# EAGLE design PowerBoard (EAGLE 6.5.0)
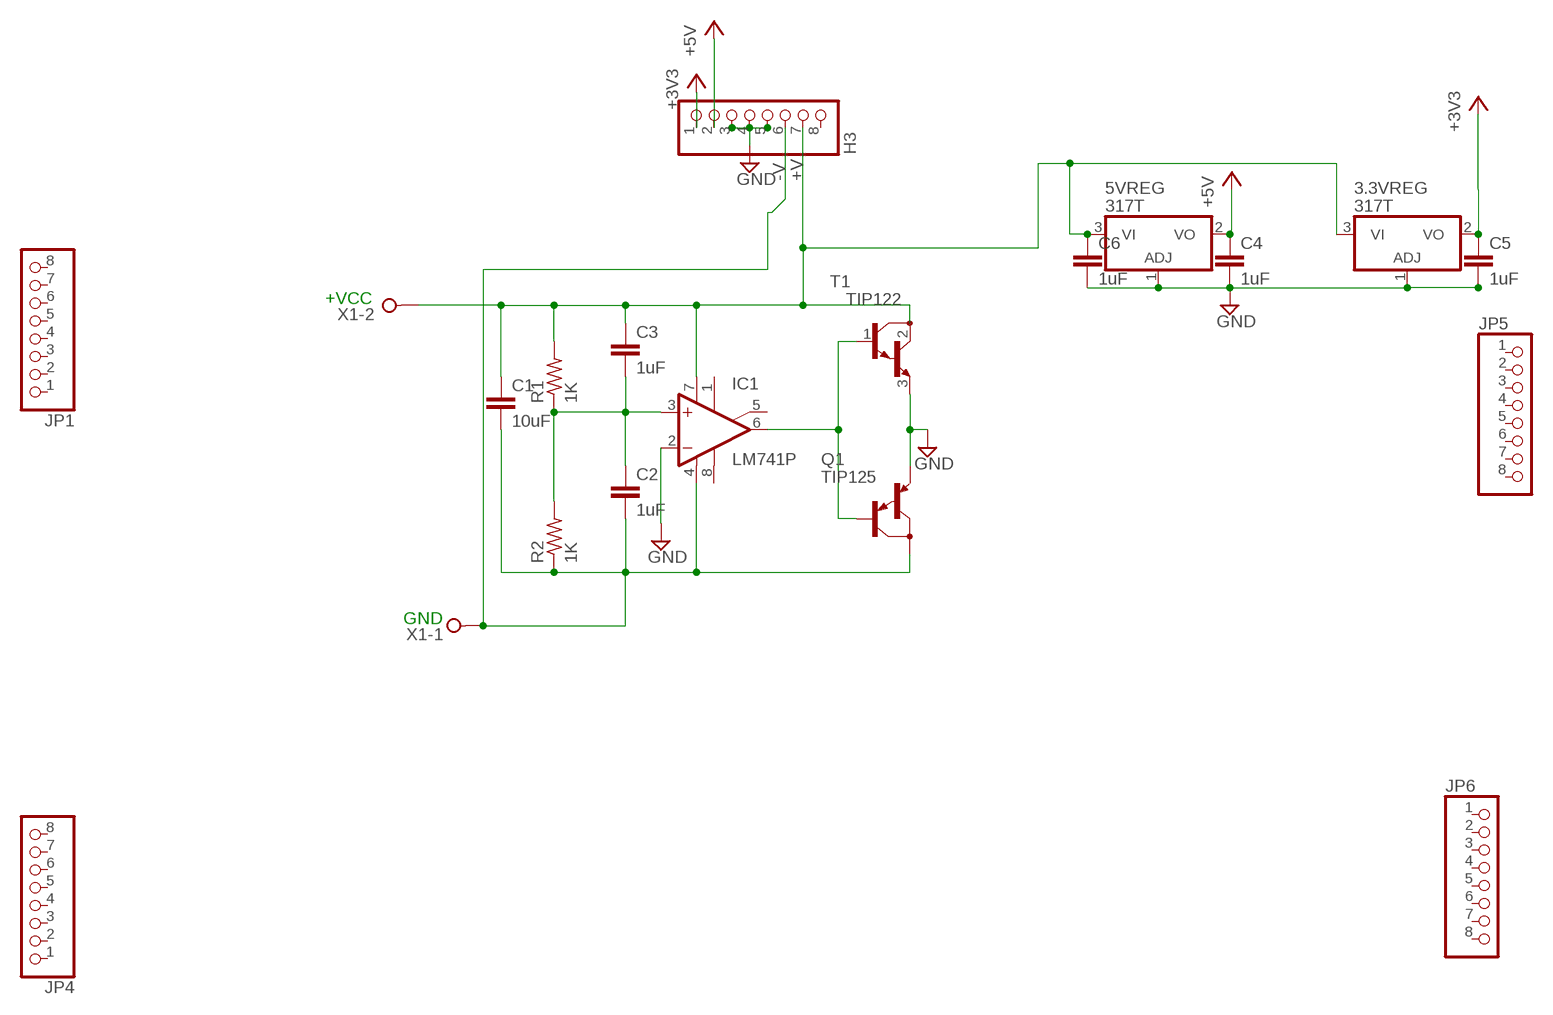
[diagram p0: schematic, sheet 1]

## Parts
3.3VREG  317T  [TO220H]
5VREG  317T  [TO220H]
C1  10uF  C2.5/2  [C2.5-2]
C2  1uF  C2.5/2  [C2.5-2]
C3  1uF  C2.5/2  [C2.5-2]
C4  1uF  C2.5/2  [C2.5-2]
C5  1uF  C2.5/2  [C2.5-2]
C6  1uF  C2.5/2  [C2.5-2]
IC1  LM741P  [DIL08]
JP1  PINHD-1X8  [1X08]
JP3  H3  PINHD-1X8  [1X08]
JP4  PINHD-1X8  [1X08]
JP5  PINHD-1X8  [1X08]
JP6  PINHD-1X8  [1X08]
Q1  TIP125  [TO220]
R1  1K  R-US_0207/7  [0207/7]
R2  1K  R-US_0207/7  [0207/7]
T1  TIP122  [TO220]
X1  W237-02P  [W237-132]

## Nets
+3V3: 3.3VREG.2(VO) C5.1 JP3.1
+5V: 5VREG.2(VO) C4.1 JP3.2
GND: 3.3VREG.1(ADJ) 5VREG.1(ADJ) C4.2 C5.2 C6.2 IC1.2(-IN) JP3.3 JP3.4 JP3.5 Q1.3(E) T1.3(E)
N$3: C1.2 C2.2 IC1.4(V-) JP3.6 Q1.2(C) R2.1 X1.1
N$4: 3.3VREG.3(VI) 5VREG.3(VI) C1.1 C3.1 C6.1 IC1.7(V+) JP3.7 R1.2 T1.2(C) X1.2
N$5: IC1.6(OUT) Q1.1(B) T1.1(B)
N$6: C2.1 C3.2 IC1.3(+IN) R1.1 R2.2
Unconnected: IC1.1(ON1) IC1.5(ON2) IC1.8(OPT) JP1.1 JP1.2 JP1.3 JP1.4 JP1.5 JP1.6 JP1.7 JP1.8 JP3.8 JP4.1 JP4.2 JP4.3 JP4.4 JP4.5 JP4.6 JP4.7 JP4.8 JP5.1 JP5.2 JP5.3 JP5.4 JP5.5 JP5.6 JP5.7 JP5.8 JP6.1 JP6.2 JP6.3 JP6.4 JP6.5 JP6.6 JP6.7 JP6.8

## Notes on the sheet
- -V | +V
- +VCC
- GND

## Library data of the parts
3.3VREG 5VREG = linear:*317: Positive VOLTAGE REGULATOR
C1-C6 = capacitor-wima:C: CAPACITOR naming: grid - package width
IC1 = linear:*741: OP AMP
JP1 JP3-JP6 = pinhead:PINHD-1X8: PIN HEADER
Q1 = transistor-pnp:TIP125: PNP Transistor
R1 R2 = resistor:R-US_: RESISTOR, American symbol
T1 = transistor:TIP122: NPN BIPOLAR DARLINGTON TRANSISTOR
X1 = con-wago-508:W237-02P: WAGO SREW CLAMP; OC_FARNELL: unknown; OC_NEWARK: unknown

## Board
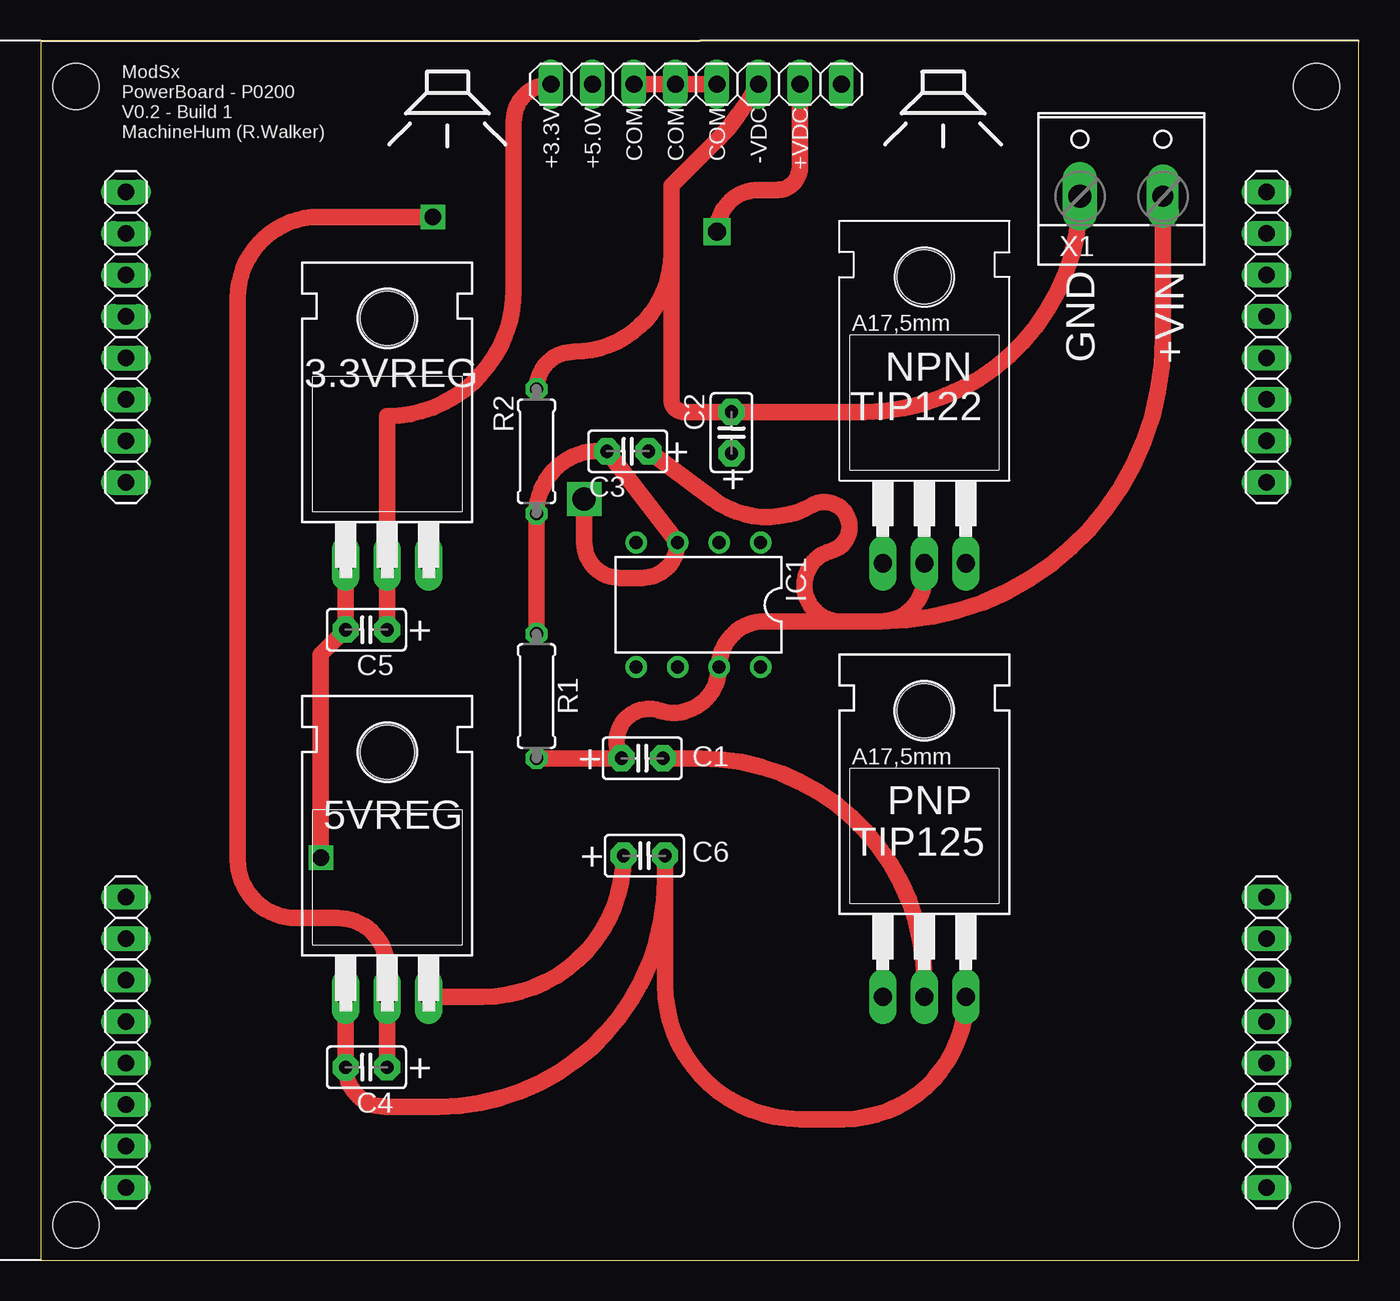
[diagram p1: board, top side]
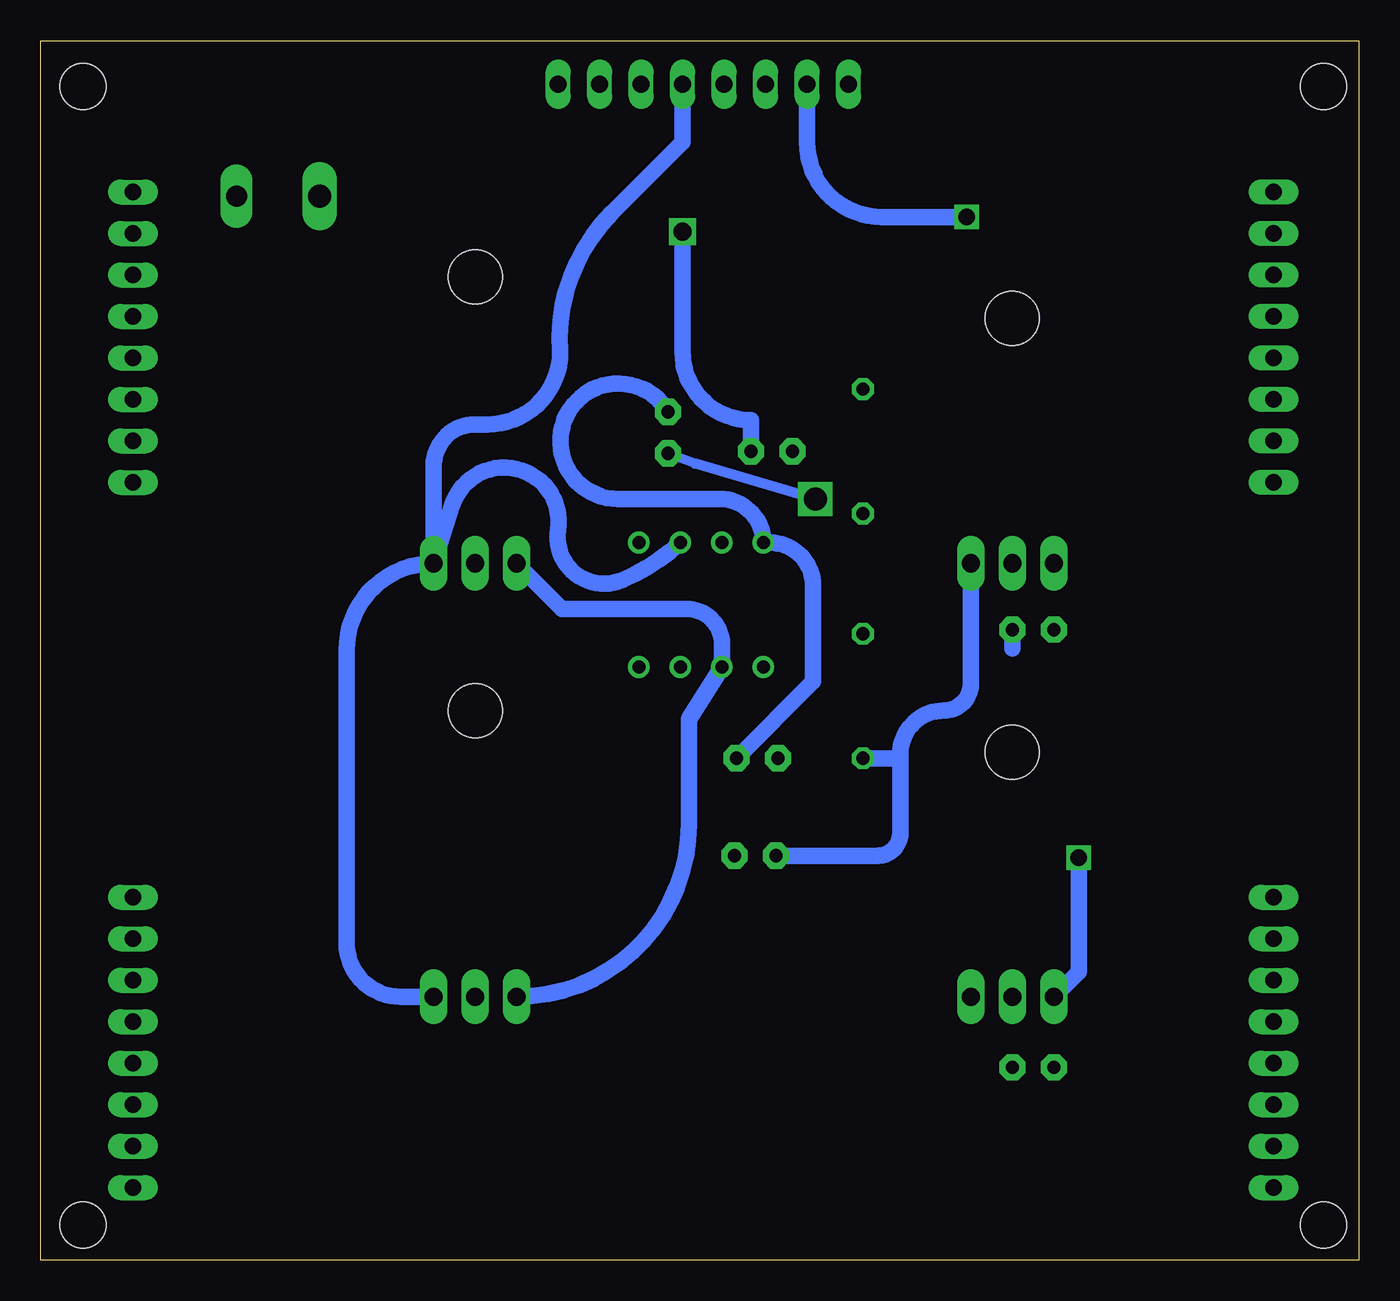
[diagram p2: board, bottom side, seen from below]

Size 80.7 x 74.67 mm. Coordinates in mm from the lower left corner, seen from the top.
Outline: 0,0 80.7,0 80.7,74.67 0,74.67 0,0
Copper layers (1*16): Top 0.035mm / dielectric 1.5mm / Bottom 0.035mm
Design rules "default": minimum track width 10mil, minimum drill 24mil, track to track 8mil, track to pad 8mil, pad to pad 8mil, via to via 8mil, smd to smd 8mil, copper to edge 40mil, drill to drill 8mil, minimum pad ring 10mil, minimum via ring 8mil, stop-mask expansion 4mil, vias tented up to drill 0mil, thermal gap 10mil
Holes 2.8 mm at 2.16,71.88 2.16,2.16 78.11,71.88 78.11,2.16

### Footprints (pad centres in the part's own frame; a part is rotated, then mirrored left to right if it is on the bottom)
TO220H = drill 1.118 long: 1 -2.54,-10.16; 2 0,-10.16; 3 2.54,-10.16 | hole 3.302: 0,4.826
C2.5-2 = drill 0.813 pad 1.6 octagon: 1 -1.27,0; 2 1.27,0
DIL08 = drill 0.813 pad 1.27: 1 -3.81,-3.81; 2 -1.27,-3.81; 3 1.27,-3.81; 4 3.81,-3.81; 5 3.81,3.81; 6 1.27,3.81; 7 -1.27,3.81; 8 -3.81,3.81
1X08 = drill 1.016 long: 1 -8.89,0; 2 -6.35,0; 3 -3.81,0; 4 -1.27,0; 5 1.27,0; 6 3.81,0; 7 6.35,0; 8 8.89,0
TO220 = drill 1.118 long: 1 -2.54,-6.35; 2 0,-6.35; 3 2.54,-6.35 | hole 3.302: 0,11.176
0207/7 = drill 0.813 octagon: 1 -3.81,0; 2 3.81,0
W237-132 = drill 1.4 long: 1 -2.54,-0.635 | drill 1.3 long: 2 2.54,-0.635

### Placement (x,y rotation side)
3.3VREG  21.21,52.83 0 top
5VREG  21.21,26.29 0 top
C1  36.83,30.73 0 top
C2  42.29,50.67 90 top
C3  35.94,49.53 180 top
C4  19.94,11.81 180 top
C5  19.94,38.61 180 top
C6  36.96,24.77 0 top
IC1  40.26,40.13 180 top
JP1  5.21,56.52 270 top
JP3  40.13,72.01 0 top
JP4  5.21,13.34 90 top
JP5  75.06,13.34 90 top
JP6  75.06,56.52 90 top
Q1  54.1,22.48 0 top
R1  30.35,34.54 270 top
R2  30.35,49.53 270 top
T1  54.1,49.02 0 top
X1  66.17,65.79 0 top

### Tracks (layer width: path | path; a pad name or v marks a point on that pad's centre or on a via)
+3V3
  Top 1.016: C5.1 3.3VREG.2 21.21,51.69 arc90 28.96,59.44 28.96,69.72 arc-90 JP3.1
  Bottom 1.016: 21.21,37.47 C5.1
+5V  (via drill 1)
  Top 1.016: v24,63.88 17.02,63.88 arc90 12.06,58.93 arc90 12.06,58.8 12.06,24.51 arc90 15.62,20.95 18.16,20.95 arc-90 21.21,17.91 5VREG.2 C4.1
  Bottom 1.016: v24,63.88 29.21,63.88 arc90 33.78,68.45 JP3.2
GND  (via drill 1)
  Top 1.016: JP3.5 JP3.4 JP3.3 | 5VREG.1 C4.2 arc90 21.08,9.4 24.38,9.4 arc90 38.23,23.24 C6.2 38.23,16.89 arc90 46.48,8.64 49.15,8.64 arc90 Q1.3 | 3.3VREG.1 C5.2 17.14,37.08 v17.14,24.64
  Bottom 1.016: T1.3 arc-90 61.98,37.34 61.98,19.43 arc-90 58.67,16.13 Q1.3 | T1.3 55.5,46.23 arc171 49.02,44.7 arc-122 45.09,41.66 arc-19 IC1.2 | JP3.5 41.4,68.45 45.72,64.14 arc-49 48.9,55.63 arc90 53.34,51.18 54.1,51.18 arc-90 56.64,48.64 T1.3 | v17.14,24.64 17.14,17.65 5VREG.1
N$3
  Top 1.016: JP3.6 arc-16 41.27,68.45 38.61,65.79 38.61,61.59 | R2.1 arc-90 32.64,55.63 arc90 38.61,61.59 | Q1.2 54.1,17.02 arc90 40.39,30.73 C1.2 | X1.1 arc-90 50.42,51.94 C2.2 39.37,51.94 arc-90 38.61,52.7 38.61,61.59
  Bottom 1.016: C2.2 arc-239 45.34,46.61 39.12,46.61 arc90 IC1.4 36.07,43.94 arc90 33.4,41.27 33.4,35.43 C1.2
N$4  (via drill 1.1)
  Top 1.016: R1.2 C1.1 arc-140 37.85,33.66 arc108 IC1.7 arc-90 44.32,39.12 49.02,39.12 | T1.2 54.1,41.78 arc-90 51.44,39.12 | 51.44,39.12 49.02,39.12 | C3.1 41.15,46.61 arc66 47.24,46.23 arc-194 48.39,43.43 arc167 49.02,39.12 | 5VREG.3 27.05,16.13 arc90 C6.1 | X1.2 68.71,56.39 arc-90 51.44,39.12 | 46.48,70.87 JP3.7 46.48,66.93 arc-90 45.09,65.53 43.94,65.53 arc90 v41.4,62.99
  Bottom 1.016: C3.1 37.21,51.44 arc90 41.4,55.63 v41.4,62.99 | 3.3VREG.3 23.75,35.31 arc90 25.4,33.66 arc-90 28.07,30.99 | 28.07,30.99 28.07,26.16 arc90 29.46,24.77 C6.1 | R1.2 28.32,30.73 arc-90 28.07,30.99
N$5
  Bottom 1.016: T1.1 48.77,39.88 41.15,39.88 arc90 38.99,37.72 IC1.6 41.02,33.15 41.02,26.67 arc90 Q1.1
N$6  (via drill 1.4)
  Top 1.016: R1.1 R2.2 arc-97 C3.2 IC1.3 arc-90 36.83,41.78 35.43,41.78 arc-90 33.27,43.94 v33.27,46.61
  Bottom 0.61: v33.27,46.61 40.64,48.77 C2.1

### Text on the board
tPlace: +3.3V | +5.0V | COM | COM | COM | -VDC | +VDC | ModSx / PowerBoard - P0200 / V0.2 - Build 1 / MachineHum (R.Walker) | GND | +VIN | NPN | TIP122 | + | + | + | + | PNP | TIP125 | + | +